# EAGLE design NXPESC-UF1_test (EAGLE 7.6.0)
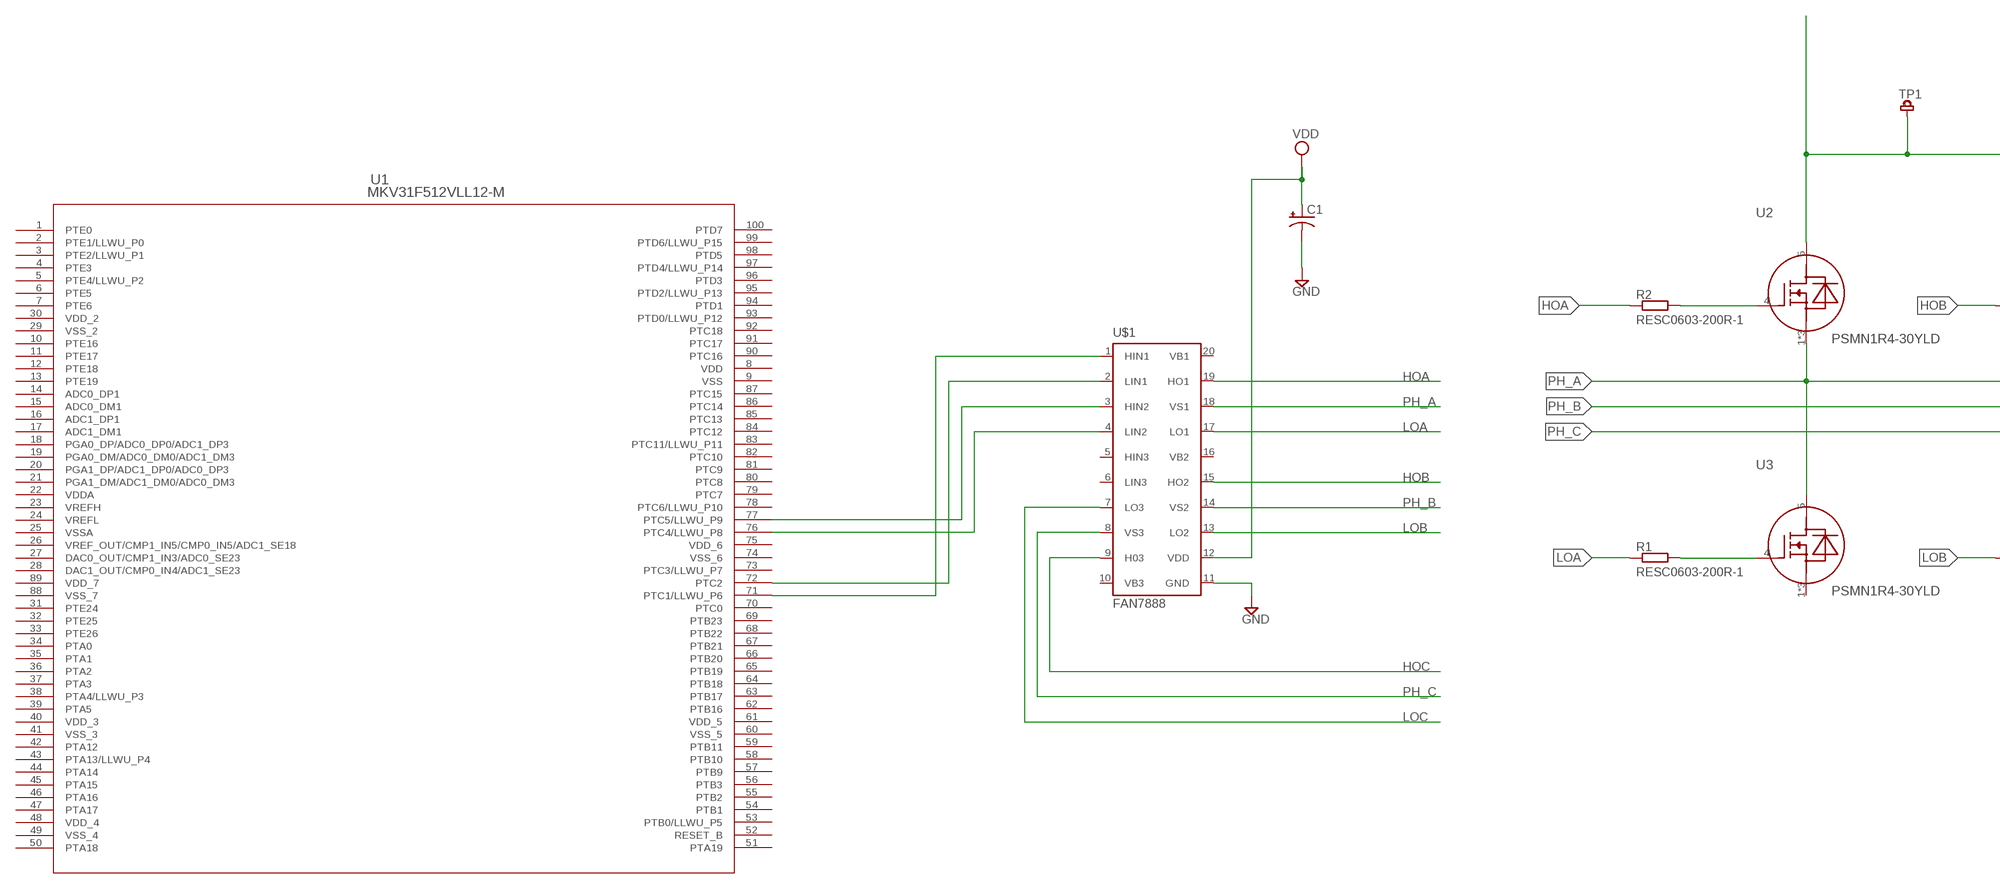
[diagram p0: schematic, sheet 1, part 1 of 2]
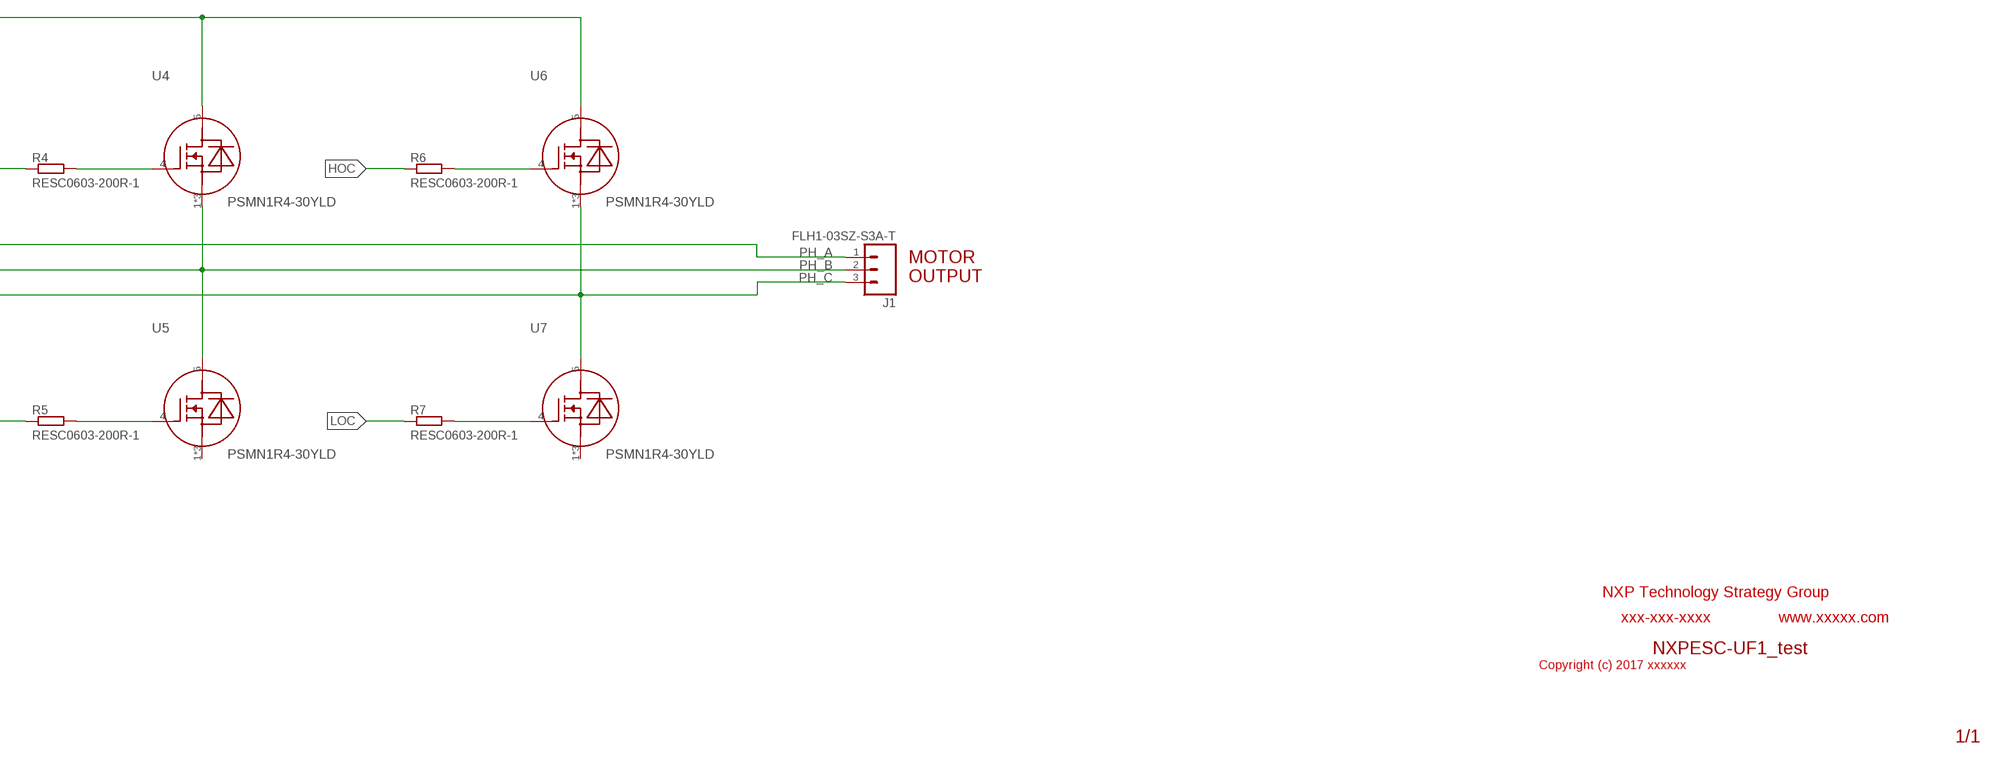
[diagram p1: schematic, sheet 1, part 2 of 2]

## Parts
C1  CAP_POL1206  [EIA3216]
J1  FLH1-03SZ-S3A-T  [J3]
R1  RESC0603-200R-1  [C0603]
R2  RESC0603-200R-1  [C0603]
R4  RESC0603-200R-1  [C0603]
R5  RESC0603-200R-1  [C0603]
R6  RESC0603-200R-1  [C0603]
R7  RESC0603-200R-1  [C0603]
TP1  TP-TH-SMLL  [TP-SMLL]
U1  MKV31F512VLL12-M  [LQFP-100_14X14X1_7-M]
U2  PSMN1R4-30YLD  [LFPAK56]
U3  PSMN1R4-30YLD  [LFPAK56]
U4  PSMN1R4-30YLD  [LFPAK56]
U5  PSMN1R4-30YLD  [LFPAK56]
U6  PSMN1R4-30YLD  [LFPAK56]
U7  PSMN1R4-30YLD  [LFPAK56]
U$1  FAN7888  [SOIC-20]

## Nets
GND: C1.C(-) U$1.11(GND)
HOA: R2.1 U$1.19(HO1)
HOB: R4.1 U$1.15(HO2)
HOC: R6.1 U$1.9(H03)
LOA: R1.1 U$1.17(LO1)
LOB: R5.1 U$1.13(LO2)
LOC: R7.1 U$1.7(LO3)
N$2: TP1.1 U2.5(D) U4.5(D) U6.5(D)
N$5: U1.71(PTC1/LLWU_P6) U$1.1(HIN1)
N$6: U1.72(PTC2) U$1.2(LIN1)
N$7: U1.77(PTC5/LLWU_P9) U$1.3(HIN2)
N$8: U1.76(PTC4/LLWU_P8) U$1.4(LIN2)
N$11: R2.2 U2.4(G)
N$12: R1.2 U3.4(G)
N$13: R4.2 U4.4(G)
N$14: R5.2 U5.4(G)
N$15: R6.2 U6.4(G)
N$16: R7.2 U7.4(G)
PH_A: J1.1 U2.1(S) U2.2(S) U2.3(S) U3.5(D) U$1.18(VS1)
PH_B: J1.2 U4.1(S) U4.2(S) U4.3(S) U5.5(D) U$1.14(VS2)
PH_C: J1.3 U6.1(S) U6.2(S) U6.3(S) U7.5(D) U$1.8(VS3)
VDD: C1.A(+) U$1.12(VDD)
Unconnected: U1.1(PTE0) U1.2(PTE1/LLWU_P0) U1.3(PTE2/LLWU_P1) U1.4(PTE3) U1.5(PTE4/LLWU_P2) U1.6(PTE5) U1.7(PTE6) U1.10(PTE16) U1.11(PTE17) U1.12(PTE18) U1.13(PTE19) U1.14(ADC0_DP1) U1.15(ADC0_DM1) U1.16(ADC1_DP1) U1.17(ADC1_DM1) U1.18(PGA0_DP/ADC0_DP0/ADC1_DP3) U1.19(PGA0_DM/ADC0_DM0/ADC1_DM3) U1.20(PGA1_DP/ADC1_DP0/ADC0_DP3) U1.21(PGA1_DM/ADC1_DM0/ADC0_DM3) U1.26(VREF_OUT/CMP1_IN5/CMP0_IN5/ADC1_SE18) U1.27(DAC0_OUT/CMP1_IN3/ADC0_SE23) U1.28(DAC1_OUT/CMP0_IN4/ADC1_SE23) U1.31(PTE24) U1.32(PTE25) U1.33(PTE26) U1.34(PTA0) U1.35(PTA1) U1.36(PTA2) U1.37(PTA3) U1.38(PTA4/LLWU_P3) U1.39(PTA5) U1.42(PTA12) U1.43(PTA13/LLWU_P4) U1.44(PTA14) U1.45(PTA15) U1.46(PTA16) U1.47(PTA17) U1.50(PTA18) U1.51(PTA19) U1.52(RESET_B) U1.53(PTB0/LLWU_P5) U1.54(PTB1) U1.55(PTB2) U1.56(PTB3) U1.57(PTB9) U1.58(PTB10) U1.59(PTB11) U1.62(PTB16) U1.63(PTB17) U1.64(PTB18) U1.65(PTB19) U1.66(PTB20) U1.67(PTB21) U1.68(PTB22) U1.69(PTB23) U1.70(PTC0) U1.73(PTC3/LLWU_P7) U1.78(PTC6/LLWU_P10) U1.79(PTC7) U1.80(PTC8) U1.81(PTC9) U1.82(PTC10) U1.83(PTC11/LLWU_P11) U1.84(PTC12) U1.85(PTC13) U1.86(PTC14) U1.87(PTC15) U1.90(PTC16) U1.91(PTC17) U1.92(PTC18) U1.93(PTD0/LLWU_P12) U1.94(PTD1) U1.95(PTD2/LLWU_P13) U1.96(PTD3) U1.97(PTD4/LLWU_P14) U1.98(PTD5) U1.99(PTD6/LLWU_P15) U1.100(PTD7) U3.1(S) U3.2(S) U3.3(S) U5.1(S) U5.2(S) U5.3(S) U7.1(S) U7.2(S) U7.3(S) U$1.5(HIN3) U$1.6(LIN3)

## Notes on the sheet
- MOTOR
  OUTPUT

## Power pins joined to a net without a drawn wire
VB1: U$1.20(VB1)
VB2: U$1.16(VB2)
VB3: U$1.10(VB3)
VDD: U1.8(VDD)
VDD_2: U1.30(VDD_2)
VDD_3: U1.40(VDD_3)
VDD_4: U1.48(VDD_4)
VDD_5: U1.61(VDD_5)
VDD_6: U1.75(VDD_6)
VDD_7: U1.89(VDD_7)
VDDA: U1.22(VDDA)
VREFH: U1.23(VREFH)
VREFL: U1.24(VREFL)
VSS: U1.9(VSS)
VSS_2: U1.29(VSS_2)
VSS_3: U1.41(VSS_3)
VSS_4: U1.49(VSS_4)
VSS_5: U1.60(VSS_5)
VSS_6: U1.74(VSS_6)
VSS_7: U1.88(VSS_7)
VSSA: U1.25(VSSA)

## Library data of the parts
C1 = pixhawk2:CAP_POL: Capacitor Polarized These are standard SMD and PTH capacitors. Normally 10uF, 47uF, and 100uF in electrolytic and tantalum varieties. Always verify the external diameter of the through hole cap, it varies with capacity, voltage, and manufacturer. The EIA devices should be standard.
J1 = etc-connector-003a:FLH1-03SZ-S3A-T: Molex 3-pin single row friction lock pin header.
R1 R2 R4-R7 = etc-rcl:RESC?-*: Resistors with ETC part numbers.
TP1 = etc-connector-003a:TP-TH-SMLL
U1 = MKV31F512VLL12:MKV31F512VLL12: The Kinetis KV3x family of MCUs delivers a high-performance solution for BLDC, PMSM and ACIM motor control applications. Built upon the ARM Cortex-M4 core running at 100 or 120 MHz with DSP instruction set and floating point unit, the KV3 devices feature dual 16-bit analog-to-digital converters (ADCs) sampling at up to 1.2 mega samples per second (MSPS) in 12-bit mode, multiple motor control timers, 64 to 512 KB of flash memory and a comprehensive enablement suite from proprietary and third-party resources, including reference designs for ACIM, BLDC and PMSM motor control built on NXP's Embedded Software libraries and motor configuration tools. The KV3x is the first device in the Kinetis V portfolio to be enabled with Kinetis Motor Suite (KMS). KMS is a software solution that enables the rapid configuration of motor drive systems, and accelerates development of the final motor drive application, whilst improving overall motor system performance. KMS simplifies motor control across variable speeds and loads of any type of 3-ph PMSM motor regardless of power level. For more information on Kinetis Motor Suite go to nxp.com/kms
U2-U7 = PSMN1R2-25YL_115:PSMN1R4-30YLD: NXP PSMN1R4
U$1 = FAN7888:FAN7888

## Board
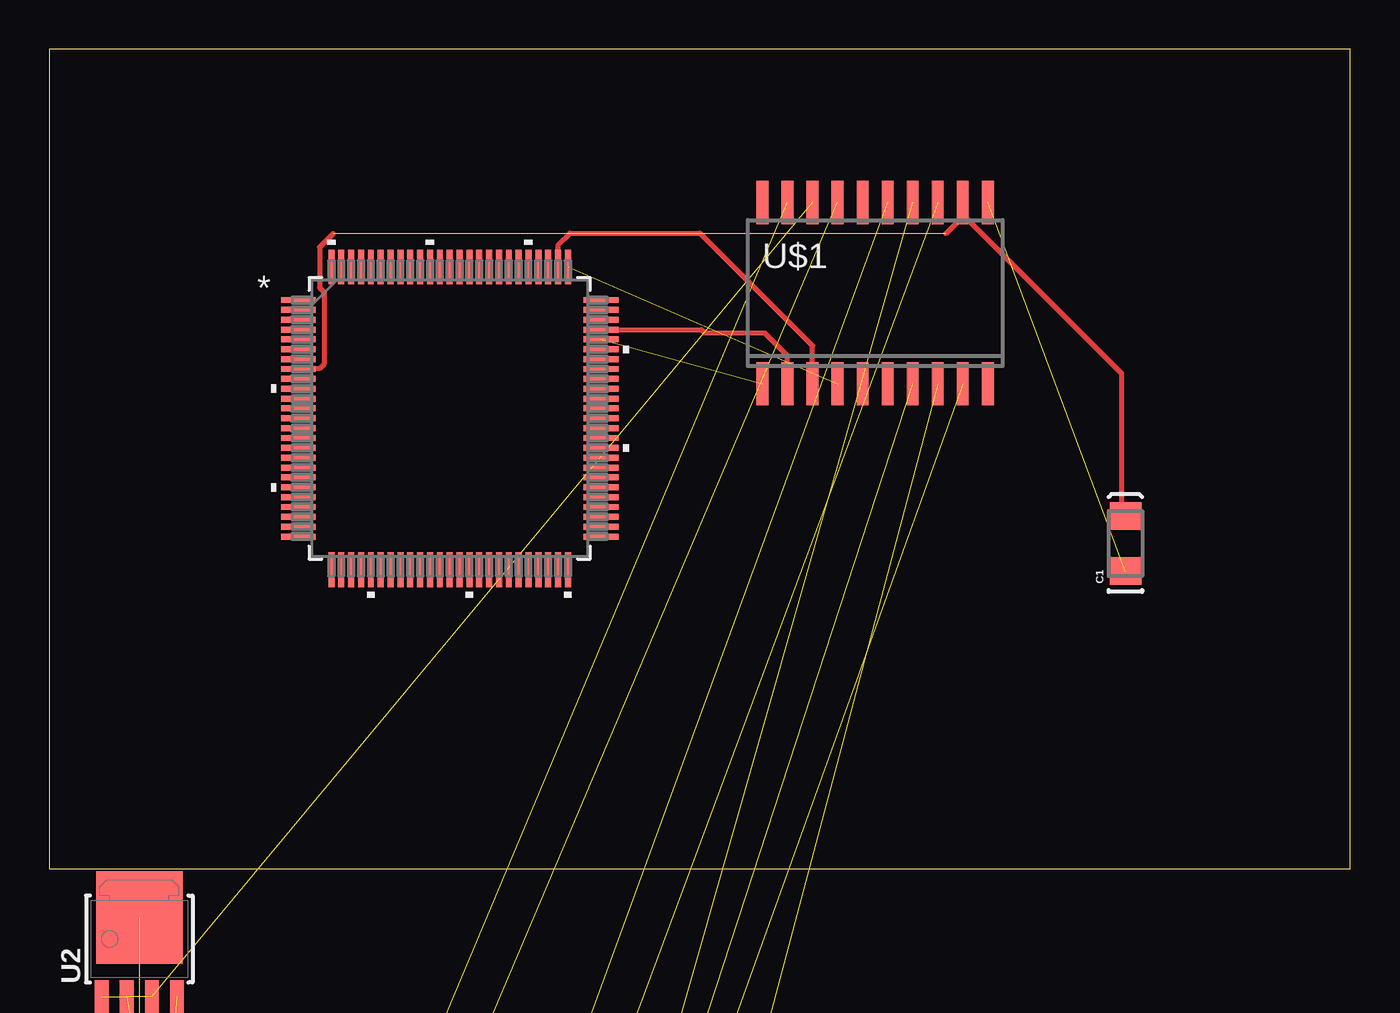
[diagram p2: board, top side]

Size 66.02 x 41.58 mm. Coordinates in mm from the lower left corner, seen from the top.
Outline: 0,0 66.02,0 66.02,41.58 0,41.58 0,0
Copper layers (1*16): Top 0.035mm / dielectric 1.5mm / Bottom 0.035mm
Design rules "default": minimum track width 10mil, minimum drill 0.6mm, track to track 8mil, track to pad 8mil, pad to pad 8mil, via to via 8mil, smd to smd 8mil, copper to edge 40mil, drill to drill 8mil, minimum pad ring 10mil, minimum via ring 8mil, stop-mask expansion 4mil, vias tented up to drill 0mil, thermal gap 10mil

### Footprints (pad centres in the part's own frame; a part is rotated, then mirrored left to right if it is on the bottom)
EIA3216 = smd 1.4 x 1.6: A 1.4,0; C -1.4,0
J3 = drill 0.889 square: 1 -2.54,0 | drill 0.889: 2 0,0; 3 2.54,0
C0603 = smd 1.1 x 1: 1 -0.85,0; 2 0.85,0
TP-SMLL = drill 0.711 pad 1.016: 1 0,0
LQFP-100_14X14X1_7-M = smd 1.766 x 0.3: 1 -7.676,6; 2 -7.676,5.5; 3 -7.676,5; 4 -7.676,4.5; 5 -7.676,4; 6 -7.676,3.5; 7 -7.676,3; 8 -7.676,2.5; 9 -7.676,2; 10 -7.676,1.5; 11 -7.676,1; 12 -7.676,0.5; 13 -7.676,0; 14 -7.676,-0.5; 15 -7.676,-1; 16 -7.676,-1.5; 17 -7.676,-2; 18 -7.676,-2.5; 19 -7.676,-3; 20 -7.676,-3.5; 21 -7.676,-4; 22 -7.676,-4.5; 23 -7.676,-5; 24 -7.676,-5.5; 25 -7.676,-6; 51 7.676,-6; 52 7.676,-5.5; 53 7.676,-5; 54 7.676,-4.5; 55 7.676,-4; 56 7.676,-3.5; 57 7.676,-3; 58 7.676,-2.5; 59 7.676,-2; 60 7.676,-1.5; 61 7.676,-1; 62 7.676,-0.5; 63 7.676,0; 64 7.676,0.5; 65 7.676,1; 66 7.676,1.5; 67 7.676,2; 68 7.676,2.5; 69 7.676,3; 70 7.676,3.5; 71 7.676,4; 72 7.676,4.5; 73 7.676,5; 74 7.676,5.5; 75 7.676,6 | smd 0.3 x 1.766: 26 -6,-7.676; 27 -5.5,-7.676; 28 -5,-7.676; 29 -4.5,-7.676; 30 -4,-7.676; 31 -3.5,-7.676; 32 -3,-7.676; 33 -2.5,-7.676; 34 -2,-7.676; 35 -1.5,-7.676; 36 -1,-7.676; 37 -0.5,-7.676; 38 0,-7.676; 39 0.5,-7.676; 40 1,-7.676; 41 1.5,-7.676; 42 2,-7.676; 43 2.5,-7.676; 44 3,-7.676; 45 3.5,-7.676; 46 4,-7.676; 47 4.5,-7.676; 48 5,-7.676; 49 5.5,-7.676; 50 6,-7.676; 76 6,7.676; 77 5.5,7.676; 78 5,7.676; 79 4.5,7.676; 80 4,7.676; 81 3.5,7.676; 82 3,7.676; 83 2.5,7.676; 84 2,7.676; 85 1.5,7.676; 86 1,7.676; 87 0.5,7.676; 88 0,7.676; 89 -0.5,7.676; 90 -1,7.676; 91 -1.5,7.676; 92 -2,7.676; 93 -2.5,7.676; 94 -3,7.676; 95 -3.5,7.676; 96 -4,7.676; 97 -4.5,7.676; 98 -5,7.676; 99 -5.5,7.676; 100 -6,7.676
LFPAK56 = smd 0.7 x 1.7: 1 -1.905,-2.94; 2 -0.635,-2.94; 3 0.635,-2.94; 4 1.905,-2.94 | smd 4.4 x 4.7: 5 0,1.1
SOIC-20 = smd 0.6 x 2.2: 1 -5.715,-4.6; 2 -4.445,-4.6; 3 -3.175,-4.6; 4 -1.905,-4.6; 5 -0.635,-4.6; 6 0.635,-4.6; 7 1.905,-4.6; 8 3.175,-4.6; 9 4.445,-4.6; 10 5.715,-4.6; 11 5.715,4.6; 12 4.445,4.6; 13 3.175,4.6; 14 1.905,4.6; 15 0.635,4.6; 16 -0.635,4.6; 17 -1.905,4.6; 18 -3.175,4.6; 19 -4.445,4.6; 20 -5.715,4.6

### Placement (x,y rotation side)
C1  54.61,16.51 90 top
J1  -4.57,-103.12 0 top  (outside the outline)
R1  1.78,-58.17 0 top  (outside the outline)
R2  1.78,-53.09 0 top  (outside the outline)
R4  1.78,-80.01 0 top  (outside the outline)
R5  1.78,-85.09 0 top  (outside the outline)
R6  1.78,-101.85 0 top  (outside the outline)
R7  1.78,-106.93 0 top  (outside the outline)
TP1  -7.11,-112.52 0 top  (outside the outline)
U1  20.32,22.86 0 top
U2  4.57,-3.56 0 top
U3  4.57,-11.18 0 top  (outside the outline)
U4  4.57,-73.66 0 top  (outside the outline)
U5  13.46,-73.66 0 top  (outside the outline)
U6  4.57,-95.5 0 top  (outside the outline)
U7  13.46,-95.5 0 top  (outside the outline)
U$1  41.91,29.21 0 top

### Tracks (layer width: path | path; a pad name or v marks a point on that pad's centre or on a via)
GND  (1 unrouted)
HOA  (1 unrouted)
HOB  (1 unrouted)
HOC  (1 unrouted)
LOA  (1 unrouted)
LOB  (1 unrouted)
LOC  (1 unrouted)
N$2  (3 unrouted)
N$5  (1 unrouted)
N$6
  Top 0.254: U$1.2 37.47,26.04 36.32,27.18 33.27,27.18 33.09,27.36 U1.72
N$7
  Top 0.254: U1.77 25.82,31.66 26.42,32.26 33.02,32.26 38.73,26.54 U$1.3
N$8  (1 unrouted)
N$11  (1 unrouted)
N$12  (1 unrouted)
N$13  (1 unrouted)
N$14  (1 unrouted)
N$15  (1 unrouted)
N$16  (1 unrouted)
PH_A  (5 unrouted)
PH_B  (5 unrouted)
PH_C  (5 unrouted)
VDD  (1 unrouted)
  Top 0.254: 46.41,33.15 54.41,25.15 54.41,18.06 C1.A | 46.41,33.15 46.41,33.6 U$1.12 46.41,33.15 | 14.4,32.23 13.72,31.55 13.72,29.49 13.95,29.26 13.95,25.6 13.72,25.38 12.8,25.38 U1.8 | 46.41,33.15 45.49,32.23